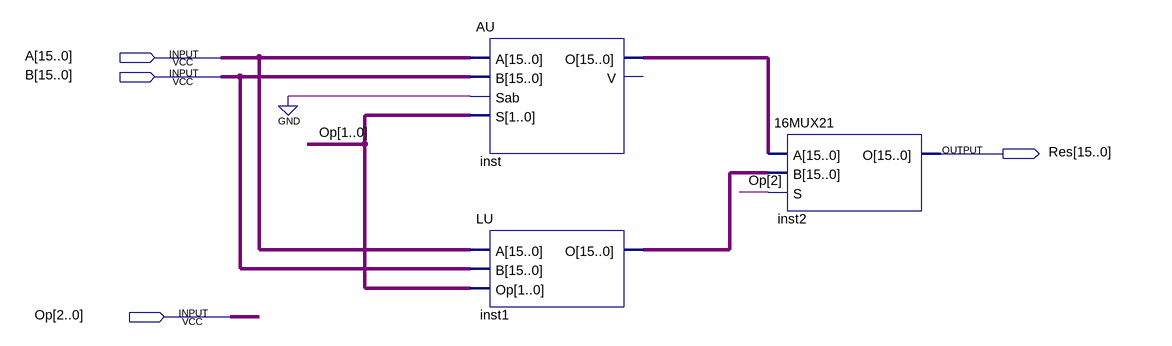
[diagram p0: schematic sheet]
// Quartus schematic ALU16.bdf as structural Verilog: 3 symbols, 4 pins
module ALU16 (
  input  [15:0] A,
  input  [15:0] B,
  input  [2:0] Op,
  output [15:0] Res
);

  wire [15:0] inst1_o, inst_o;

  AU inst (.A(A), .B(B), .Sab(1'b0), .S(Op[1:0]), .O(inst_o));  // open: V
  LU inst1 (.A(A), .B(B), .Op(Op[1:0]), .O(inst1_o));
  \16MUX21  inst2 (.A(inst_o), .B(inst1_o), .S(Op[2]), .O(Res));
endmodule
